# EAGLE design Large Mosfet (EAGLE 6.4)
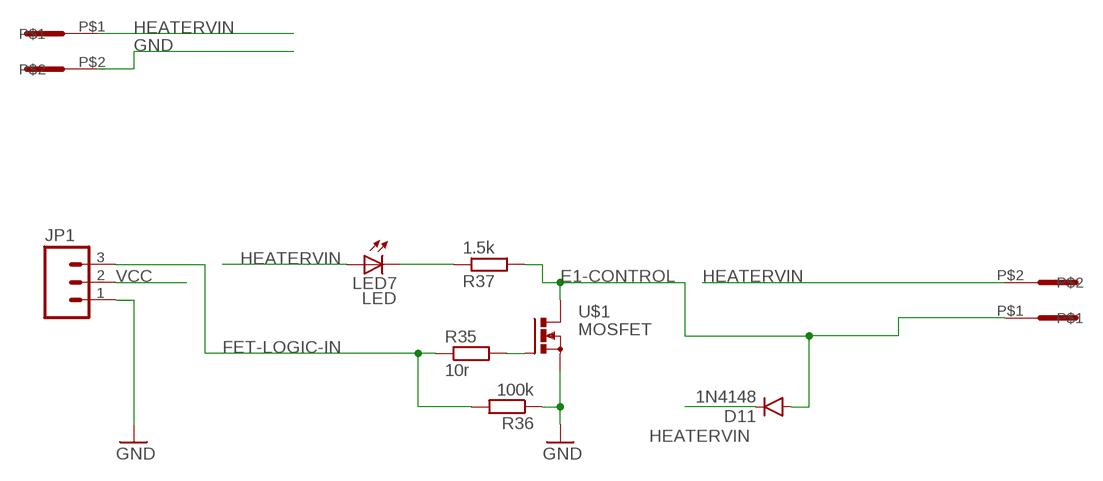
[diagram p0: schematic, sheet 1]

## Parts
D11  1N4148  DIODEBAS16  [SOD-323]
JP1  M03LOCK  [1X03_LOCK]
LED7  LED  LEDSML0603  [SML0603]
R35  10r  R-EU_R0603  [R0603]
R36  100k  R-EU_R0603  [R0603]
R37  1.5k  R-EU_R0603  [R0603]
U$1  MOSFET  N-POWER-MOSFETD2PAK-MOSFET  [D2PACK]
U$2  5MMCONN  [1715250000]
U$6  5MMCONN  [1715250000]

## Nets
E1-CONTROL [3.3-Amp Class]: D11.A R37.2 U$1.2(D) U$2.P$1
FET-LOGIC-IN: JP1.3 R35.1 R36.2
GND: JP1.1 R36.1 U$1.3(S) U$6.P$2
HEATERVIN: D11.C LED7.A U$2.P$2 U$6.P$1
N$28: R35.2 U$1.1(G)
N$30: LED7.C R37.1
VCC: JP1.2

## Library data of the parts
D11 = SparkFun-DiscreteSemi:DIODE: Diode These are standard reverse protection diodes and small signal diodes. SMA package can handle up to about 1A. SOD-323 can handle about 200mA. What the SOD-323 package when ordering, there are some mfgs out there that are 5-pin packages.; PROD_ID: DIO-09646; VALUE: 250mA/100V
JP1 = SparkFun-Connectors:M03: Header 3 Standard 3-pin 0.1" header. Use with straight break away headers (SKU : PRT-00116), right angle break away headers (PRT-00553), swiss pins (PRT-00743), machine pins (PRT-00117), and female headers (PRT-00115). Molex polarized connector foot print use with SKU : PRT-08232 with associated crimp pins and housings.
LED7 = led:LED: LED OSRAM: - CHIPLED LG R971, LG N971, LY N971, LG Q971, LY Q971, LO R971, LY R971 LH N974, LH R974 LS Q976, LO Q976, LY Q976 LO Q996 - Hyper CHIPLED LW Q18S LB Q993, LB Q99A, LB R99A - SideLED LS A670, LO A670, LY A670, LG A670, LP A670 LB A673, LV A673, LT A673, LW A673 LH A674 LY A675 LS A676, LA A676, LO A676, LY A676, LW A676 LS A679, LY A679, LG A679 - Hyper Micro SIDELED® LS Y876, LA Y876, LO Y876, LY Y876 LT Y87S - SmartLED LW L88C, LW L88S LB L89C, LB L89S, LG L890 LS L89K, LO L89K, LY L89K LS L896, LA L896, LO L896, LY L896 - TOPLED LS T670, LO T670, LY T670, LG T670, LP T670 LSG T670, LSP T670, LSY T670, LOP T670, LYG T670 LG T671, LOG T671, LSG T671 LB T673, LV T673, LT T673, LW T673 LH T674 LS T676, LA T676, LO T676, LY T676, LB T676, LH T676, LSB T676, LW T676 LB T67C, LV T67C, LT T67C, LS T67K, LO T67K, LY T67K, LW E67C LS E67B, LA E67B, LO E67B, LY E67B, LB E67C, LV E67C, LT E67C LW T67C LS T679, LY T679, LG T679 LS T770, LO T770, LY T770, LG T770, LP T770 LB T773, LV T773, LT T773, LW T773 LH T774 LS E675, LA E675, LY E675, LS T675 LS T776, LA T776, LO T776, LY T776, LB T776 LHGB T686 LT T68C, LB T68C - Hyper Mini TOPLED® LB M676 - Mini TOPLED Santana® LG M470 LS M47K, LO M47K, LY M47K Source: http://www.osram.convergy.de LUXEON: - LUMILED® LXK2-PW12-R00, LXK2-PW12-S00, LXK2-PW14-U00, LXK2-PW14-V00 LXK2-PM12-R00, LXK2-PM12-S00, LXK2-PM14-U00 LXK2-PE12-Q00, LXK2-PE12-R00, LXK2-PE12-S00, LXK2-PE14-T00, LXK2-PE14-U00 LXK2-PB12-K00, LXK2-PB12-L00, LXK2-PB12-M00, LXK2-PB14-N00, LXK2-PB14-P00, LXK2-PB14-Q00 LXK2-PR12-L00, LXK2-PR12-M00, LXK2-PR14-Q00, LXK2-PR14-R00 LXK2-PD12-Q00, LXK2-PD12-R00, LXK2-PD12-S00 LXK2-PH12-R00, LXK2-PH12-S00 LXK2-PL12-P00, LXK2-PL12-Q00, LXK2-PL12-R00 Source: www.luxeon.com KINGBRIGHT: KA-3528ASYC Source: www.kingbright.com
R35-R37 = resistor:R-EU_: RESISTOR, European symbol
U$1 = Cohesion_parts:N-POWER-MOSFET
U$2 U$6 = eric_sorensen:5MMCONN

## Net classes
5 3.3-Amp Class: width 1.27 mm

## Board
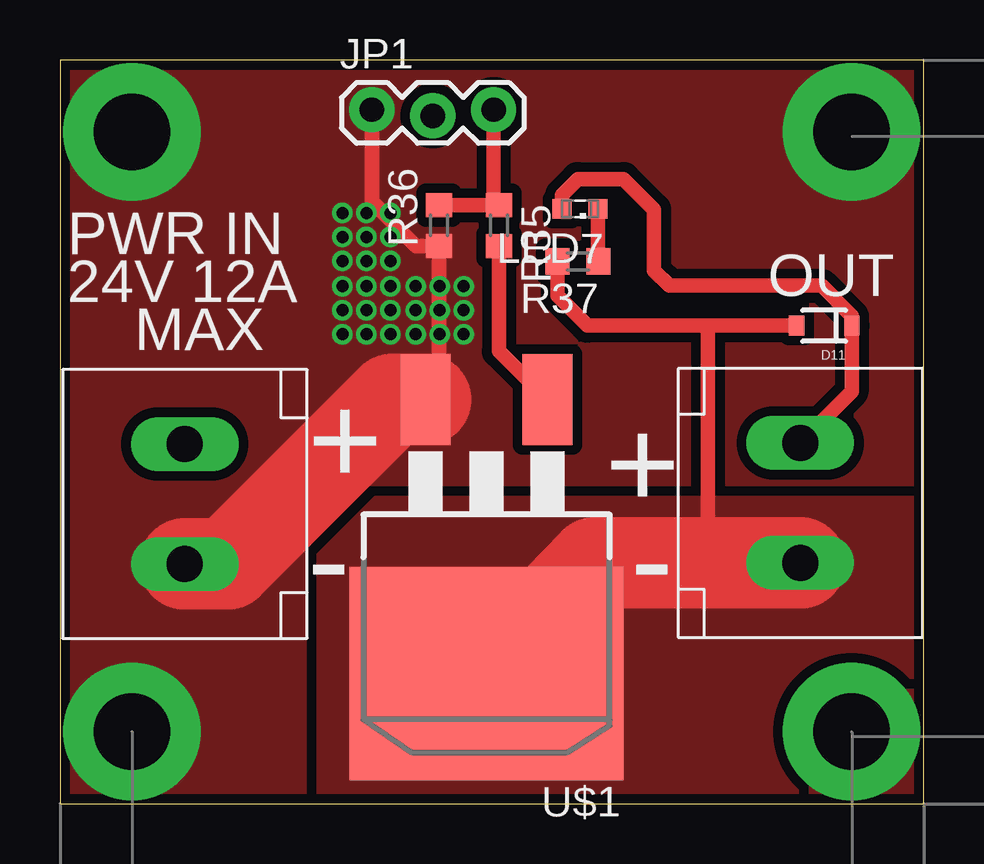
[diagram p1: board, top side]
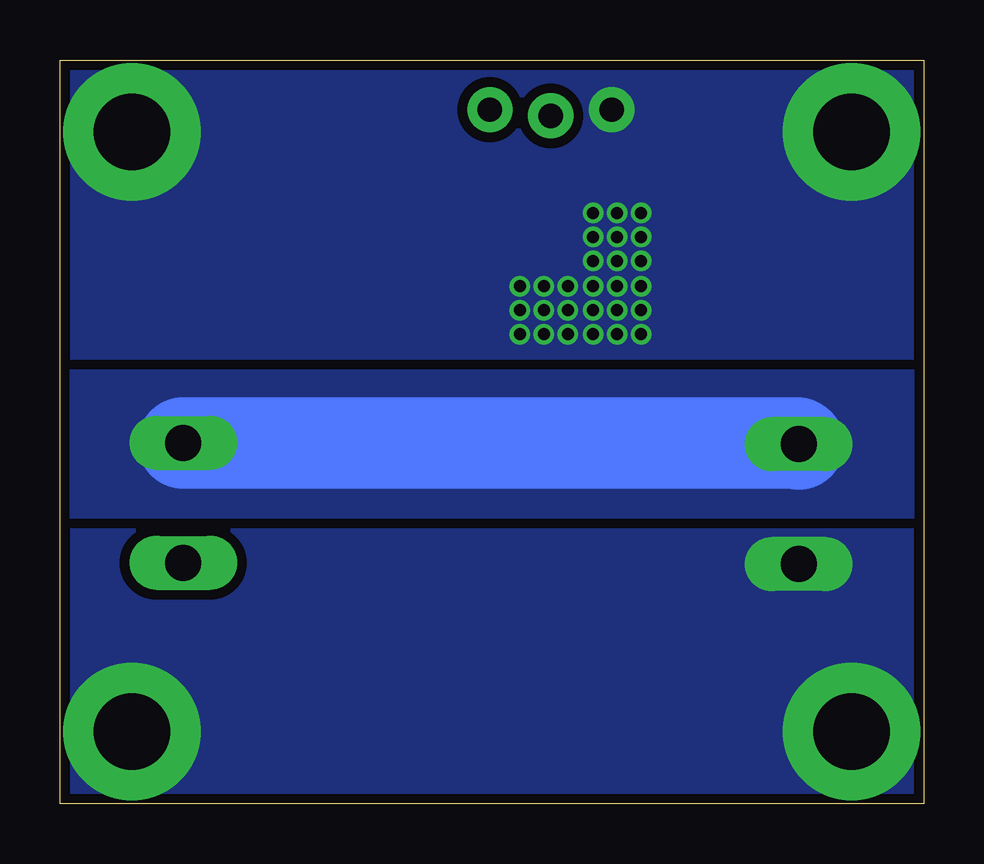
[diagram p2: board, bottom side, seen from below]

Size 36 x 31 mm. Coordinates in mm from the lower left corner, seen from the top.
Outline: 0,0 36,0 36,31 0,31 0,0
Copper layers (1*16): Top 0.0356mm / dielectric 1.5011mm / Bottom 0.0356mm
Design rules "LaenPCBOrder": minimum track width 6mil, minimum drill 13mil, track to track 6mil, track to pad 6mil, pad to pad 6mil, via to via 6mil, smd to smd 6mil, copper to edge 15mil, drill to drill 6mil, minimum pad ring 7mil, minimum via ring 7mil, stop-mask expansion 3mil, vias tented up to drill 0mil, thermal gap 10mil

### Footprints (pad centres in the part's own frame; a part is rotated, then mirrored left to right if it is on the bottom)
SOD-323 = smd 0.63 x 0.83: A 1.15,0; C -1.15,0
1X03_LOCK = drill 1.016 pad 1.88: 1 0,0.127; 2 2.54,-0.127; 3 5.08,0.127
SML0603 = smd 0.8 x 0.8: A 0.75,0; C -0.75,0
R0603 = smd 1 x 1.1: 1 -0.85,0; 2 0.85,0
D2PACK = smd 2.083 x 3.81: 1 -2.54,-8.89; 3 2.54,-8.89 | smd 11.43 x 8.89: 2 0,2.54
1715250000 = drill 1.5 long: P$1 0,0; P$2 5,0

### Placement (x,y rotation side)
D11  31.86,19.92 180 top
JP1  13,28.8 0 top
LED7  21.68,24.79 180 top
R35  18.3,24.1 270 top
R36  15.8,24.1 90 top
R37  21.59,22.6 180 top
U$1  17.78,7.95 180 top
U$2  30.86,10.03 90 top
U$6  5.21,14.99 270 top

### Tracks (layer width: path | path; a pad name or v marks a point on that pad's centre or on a via)
E1-CONTROL
  Top 0.61: R37.2 20.74,21.17 21.99,19.92 27.01,19.92 | D11.A 27.01,19.92 | 27.01,19.92 27.01,10.33 27.3,10.03
  Top 3.81: U$2.P$1 27.3,10.03 22.27,10.03 U$1.2
  pour Top (isolate 0.406, no thermals): 36.2,12.7 10.79,12.7 10.79,0 36.2,0
FET-LOGIC-IN
  Top 0.61: JP1.3 18.08,25.17 R35.1 R36.2
GND  (via drill 0.5, 3.2 pad 5.71)
  Top 0.61: U$1.3 15.8,17.4 R36.1 14.85,23.25 13,25.1 JP1.1
  Top 3.81: U$6.P$2 6.99,9.99 13.84,16.84 U$1.3
  other vias: 3,3 33,3 33,28 3,28 14.83,19.57 15.83,19.57 16.83,19.57 16.83,20.57 15.83,20.57 14.83,20.57 14.83,21.57 15.83,21.57 16.83,21.57 11.78,19.57 12.78,19.57 13.78,19.57 13.78,20.57 12.78,20.57 11.78,20.57 11.78,21.57 12.78,21.57 13.78,21.57 11.78,22.62 12.78,22.62 13.78,22.62 13.78,23.62 12.78,23.62 11.78,23.62 11.78,24.62 12.78,24.62 13.78,24.62
  pour Top (isolate 0.406, rank 5, no thermals): 0,0 36,0 36,31 0,31
  pour Bottom (isolate 0.406, rank 5, no thermals): 0,0 36,0 36,31 0,31
HEATERVIN
  Top 0.61: LED7.A 20.93,25.38 21.59,26.04 23.5,26.04 24.77,24.77 24.77,22.23 25.4,21.59 31.75,21.59 33.01,20.33 D11.C | D11.C 33.04,19.92 | D11.C 33.01,17.18 U$2.P$2
  Bottom 3.81: U$2.P$2 5.25,15.03 U$6.P$1
  pour Bottom (no thermals): 0,12 36,12 36,18 0,18
N$28
  Top 0.61: R35.2 18.3,18.86 U$1.1
N$30
  Top 0.61: LED7.C R37.1

### Text on the board
tPlace: PWR IN | 24V 12A | OUT | MAX | + | + | - | -